# Altium project imx6_devboard.PrjPcb (part 1 of 2)
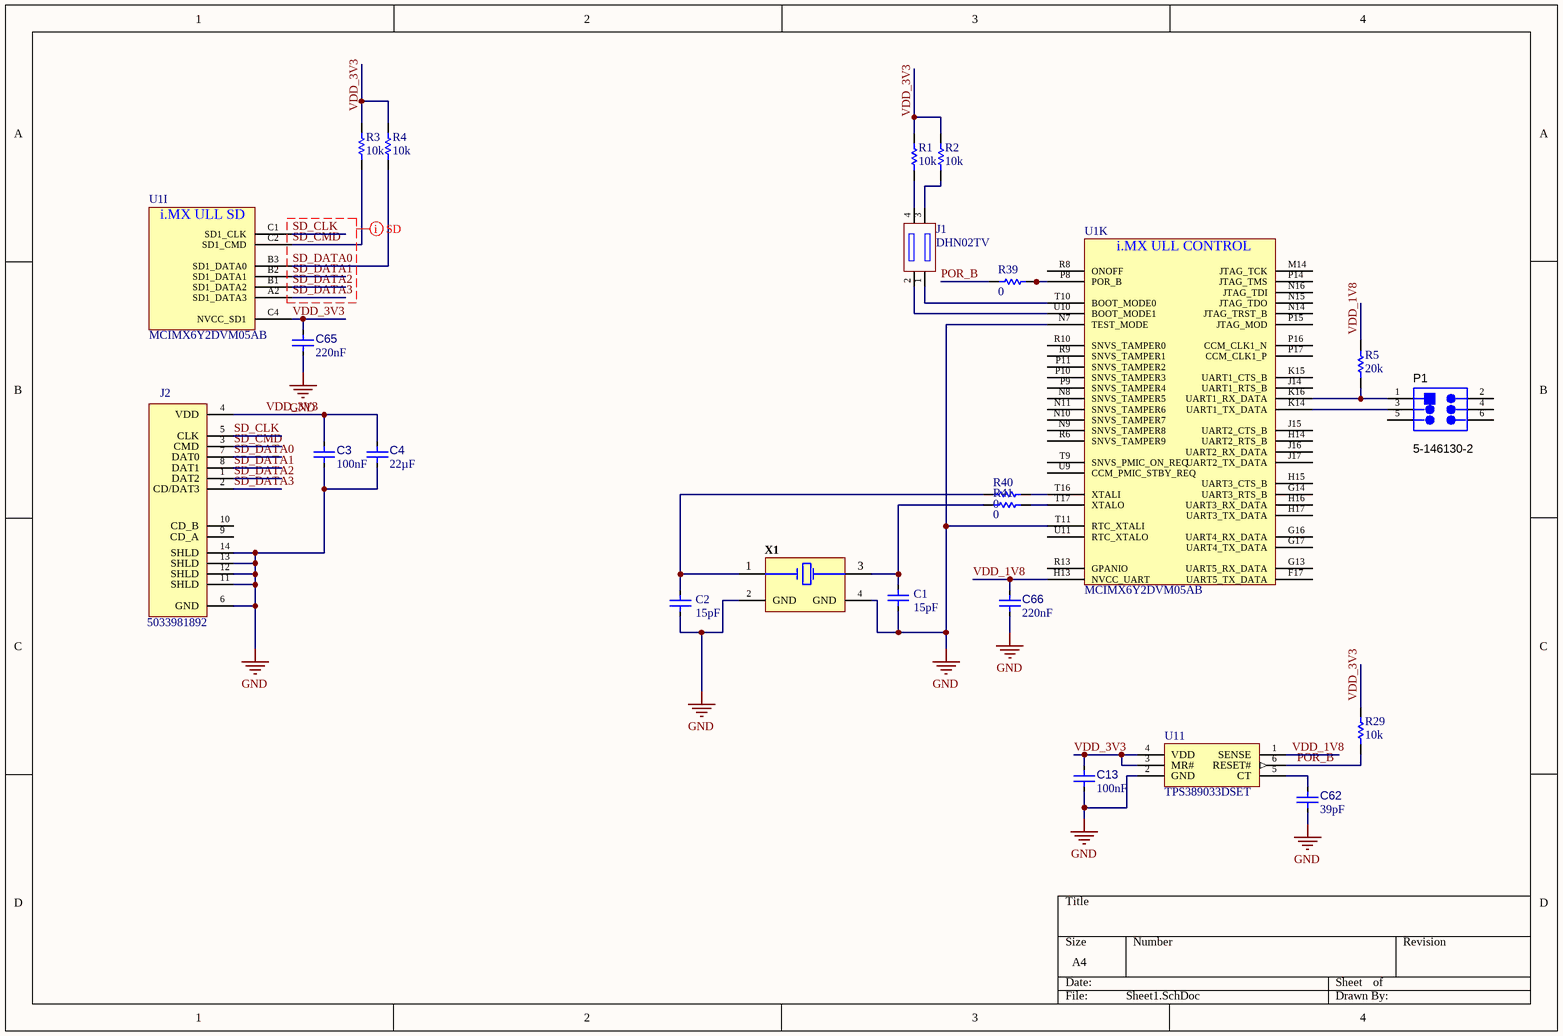
[diagram p0: Sheet1.SchDoc]
6 sheets, 169 parts. Net scope: global (net labels, ports and power ports of the same name join across sheets).
Board file: PCB.PcbDoc
Sheets:
  Sheet1.SchDoc
  Sheet2.SchDoc
  Sheet3.SchDoc
  Sheet4.SchDoc
  Sheet5.SchDoc
  Sheet6.SchDoc

## Sheet Sheet1.SchDoc
size A4; SheetNumber: 1; SheetTotal: 6

### Parts
C1  value 15pF  [0402-SMD-CAP]  (hidden comment: C0402C150J3GACTU)
C2  value 15pF  [0402-SMD-CAP]  (hidden comment: C0402C150J3GACTU)
C3  value 100nF  [0402-SMD-CAP]  (hidden comment: EMF105B7104MVHF)
C4  value 22µF  [0805-SMD-CAP]  (hidden comment: CL21A226MOQNNNE)
C13  value 100nF  [0402-SMD-CAP]  (hidden comment: EMF105B7104MVHF)
C62  value 39pF  [0402-SMD-CAP]  (hidden comment: GRM1555C1H390JA01D)
C65  value 220nF  [0402-SMD-CAP]  (hidden comment: GRM155R71C224KA12D)
C66  value 220nF  [0402-SMD-CAP]  (hidden comment: GRM155R71C224KA12D)
J1  DHN02TV  [DHN02TV-Footprint-1]
J2  5033981892  [MOLX-5033981892_V]
P1  5-146130-2  [TECO-5-146130-2_V]
R1  value 10k  [0402_SMD_RES]  (hidden comment: Resistor 10k +/-1% 0402 63 mW)
R2  value 10k  [0402_SMD_RES]  (hidden comment: Resistor 10k +/-1% 0402 63 mW)
R3  value 10k  [0402_SMD_RES]  (hidden comment: Resistor 10k +/-1% 0402 63 mW)
R4  value 10k  [0402_SMD_RES]  (hidden comment: Resistor 10k +/-1% 0402 63 mW)
R5  value 20k  [0603-SMD-RES]  (hidden comment: CRCW060320K0FKEA)
R29  value 10k  [0402_SMD_RES]  (hidden comment: Resistor 10k +/-1% 0402 63 mW)
R39  value 0  [0402_SMD_RES]  (hidden comment: RCS04020000Z0ED)
R40  value 0  [0402_SMD_RES]  (hidden comment: RCS04020000Z0ED)
R41  value 0  [0402_SMD_RES]  (hidden comment: RCS04020000Z0ED)
U1  MCIMX6Y2DVM05AB  [BGA100P9X9-81A]  (parts I,K of 11)
U11  TPS389033DSET  [TPS389033DSET-Footprint-1]
X1  TSX-322524.0000MF15X-AC3  [EPSON-TSX-3225_V]  (value not drawn)

### Nets
GND: C1.2 C2.2 C3.1 C4.1 C13.1 C62.2 C65.2 C66.2 J2.6(GND) J2.11(SHLD) J2.12(SHLD) J2.13(SHLD) J2.14(SHLD) U1.N7(TEST_MODE) U1.T11(RTC_XTALI) U11.2(GND) X1.2(GND) X1.4(GND)
POR_B: R29.1 R39.1 U11.6(RESET#)
SD_CLK: J2.5(CLK) U1.C1(SD1_CLK)
SD_CMD: J2.3(CMD) R3.1 U1.C2(SD1_CMD)
SD_DATA0: J2.7(DAT0) R4.1 U1.B3(SD1_DATA0)
SD_DATA1: J2.8(DAT1) U1.B2(SD1_DATA1)
SD_DATA2: J2.1(DAT2) U1.B1(SD1_DATA2)
SD_DATA3: J2.2(CD/DAT3) U1.A2(SD1_DATA3)
VDD_1V8: C66.1 R5.2 U1.H13(NVCC_UART) U11.1(SENSE)
VDD_3V3: C3.2 C4.2 C13.2 C65.1 J2.4(VDD) R1.2 R2.2 R3.2 R4.2 R29.2 U1.C4(NVCC_SD1) U11.3(MR#) U11.4(VDD)
NetC1_1: C1.1 R41.1 X1.3(X2)
NetC2_1: C2.1 R40.1 X1.1(X1)
NetC62_1: C62.1 U11.5(CT)
NetJ1_1: J1.1 U1.T10(BOOT_MODE0)
NetJ1_2: J1.2 U1.U10(BOOT_MODE1)
NetJ1_3: J1.3 R2.1
NetJ1_4: J1.4 R1.1
NetP1_1: P1.1 R5.1 U1.K16(UART1_RX_DATA)
NetP1_3: P1.3 U1.K14(UART1_TX_DATA)
NetR39_2: R39.2 U1.P8(POR_B)
NetR40_2: R40.2 U1.T16(XTALI)
NetR41_2: R41.2 U1.T17(XTALO)

Not connected (* = marked no-connect by the designer): J2 9(CD_A) 10(CD_B); P1 2 4 5 6; U1 F17(UART5_TX_DATA) G13(UART5_RX_DATA) G14(UART3_RTS_B) G16(UART4_RX_DATA) G17(UART4_TX_DATA) H14(UART2_RTS_B) H15(UART3_CTS_B) H16(UART3_RX_DATA) H17(UART3_TX_DATA) J14(UART1_RTS_B) J15(UART2_CTS_B) J16(UART2_RX_DATA) J17(UART2_TX_DATA) K15(UART1_CTS_B) M14(JTAG_TCK) N8(SNVS_TAMPER5) N9(SNVS_TAMPER8) N10(SNVS_TAMPER7) N11(SNVS_TAMPER6) N14(JTAG_TRST_B) N15(JTAG_TDO) N16(JTAG_TDI) P9(SNVS_TAMPER4) P10(SNVS_TAMPER3) P11(SNVS_TAMPER2) P14(JTAG_TMS) P15(JTAG_MOD) P16(CCM_CLK1_N) P17(CCM_CLK1_P) R6(SNVS_TAMPER9) R8(ONOFF) R9(SNVS_TAMPER1) R10(SNVS_TAMPER0) R13(GPANIO) T9(SNVS_PMIC_ON_REQ) U9(CCM_PMIC_STBY_REQ) U11(RTC_XTALO)

### Layout directives
net class SD; rule Matched Net Lengths [Delay Tolerance = 100ps]: SD_CLK, SD_CMD, SD_DATA0, SD_DATA1, SD_DATA2, SD_DATA3

### Notes on the sheet
- (in symbol CMP-003-000001-14, part I) i.MX ULL SD
- (in symbol CMP-003-000001-14, part K) i.MX ULL CONTROL

### Library data of the parts
C1 C2 = CMP-001-00085-9: Cap Ceramic 15pF 25V C0G 5% SMD 0402 125C Paper T/R; Tolerance: 5%; Voltage Rating: 25V; Capacitor Type: Ceramic
C3 C13 = CMP-001-00001-14: Chip Capacitor, 0.1 uF, +/- 5%, 16 V, 0402 (1005 Metric); Capacitor Type: Ceramic; Voltage Rating: 16V; Case/Package: 0402; Max Operating Temperature: 125°C; Mounting Technology: SM; RoHS Compliant: True; Pins: 2; Min Operating Temperature: -55°C; Tolerance: 5%; Mfr. Part No.: EMF105B7104MVHF
C4 = CMP-001-00081-10: Chip Capacitor, 22µF +/-40%, 16V, 0805, Thickness 1.45 mm; Tolerance: 5%; Min Operating Temperature: -55°C; Case/Package: 0805; Max Operating Temperature: 85°C; Pins: 2; Mounting Technology: SMT; Voltage Rating: 16V; Mfr. Part No.: CL21A226MOQNNNE
C62 = CMP-001-00088-5: Cap Ceramic 39pF 50V C0G 5% SMD 0402 125C Paper T/R; Temperature Coefficient: 30ppm/°C; Capacitance: 39pF; Case/Package: 0402; Package Quantity: 10000; Series: GRM; Termination: SMD/SMT; Width: 0.02inch; Dielectric: C0G; Thickness: 0.022inch; Construction: Flat; Min Operating Temperature: -55°C; Case Code (Imperial): 0402; Radiation Hardening: No; Voltage: 50V; Number of Pins: 2; Lead Free: Lead Free; Height: 0.5mm; Depth: 0.5mm; Material: Ceramic; Length: 1mm; REACH SVHC: No SVHC; Packaging: Tape and Reel; Max Operating Temperature: 125°C; Voltage Rating (DC): 50V; Case Code (Metric): 1005; Mount: Surface Mount; Voltage Rating: 50V; Tolerance: 5%
C65 C66 = CMP-001-00090-10: MURATA - GRM155R71C224KA12D - SMD Multilayer Ceramic Capacitor, 0.22 µF, 16 V, 0402 [1005 Metric], ± 10%, X7R, GRM Series; Voltage: 16V; Package Quantity: 1; Height: 0.5mm; Tolerance: 10%; Case/Package: 0402; Case Code (Metric): 1005; Packaging: Tape and Reel; Min Operating Temperature: -55°C; Mount: Surface Mount; RoHS Compliant: Yes; Thickness: 0.022inch; Depth: 0.5mm; Lead Free: Lead Free; Series: GRM; REACH SVHC: No SVHC; Width: 0.02inch; Voltage Rating: 16V; Material: Ceramic; Radiation Hardening: No; Voltage Rating (DC): 16V; Capacitance: 220nF; Max Operating Temperature: 125°C; Length: 1mm; Construction: Flat; Dielectric: X7R; Termination: SMD/SMT; Case Code (Imperial): 0402
J1 = CMP-00003-7: 1/2 Pitch DIP Switch; Voltage Rating (DC): 50V; Number of Positions: 2; Min Operating Temperature: -40°C; Mount: Surface Mount; Max Operating Temperature: 85°C; Terminal Pitch: 1.27mm; Package Quantity: 125; Contact Material: Bronze; Contact Plating: Gold
J2 = CMP-002-00049-6: Micro SD Card Connector, Pitch 1.1 mm, 8 Position, Height 1.4 mm, -25 to 85 degC, RoHS, Tape and Reel; Pins: 14
P1 = CMP-002-00018-5: Male Header, Pitch 2.54 mm, 2 x 3 Position, Height 8.13 mm, -65 to 125 degC, RoHS, Tube; Manufacturer: TE Connectivity; Gender: Male; Min Operating Temperature: -65°C; Datasheet Version: Oct-15; Connector Type: Header; RoHS Compliant: Unknown; Max Operating Temperature: 125°C; Case/Package: 5-146130-2; Package Reference: 5-146130-2; Mounting Technology: SM; Manufacturer URL: http://www.te.com/; Package Description: Male Header, Pitch 2.54 mm, 2 x 3 Position, Height 8.13 mm; Datasheet URL: http://www.te.com/commerce/DocumentDelivery/DDEController?Action=showdoc&DocId=Customer+Drawing%7F146130%7FM%7Fpdf%7FEnglish%7FENG_CD_146130_M.pdf%7F5-146130-2
R1-R4 R29 = CMP-009-00019-13: Chip Resistor, 10 KOhm, +/- 1%, 63 mW, -55 to 155 degC, 0402 (1005 Metric); Voltage Rating: 50V; Power: 63mW; Min Operating Temperature: -55°C; Pins: 2; Case/Package: 0402; Max Operating Temperature: 155°C; Resistance: 10k; Mounting Technology: SM; RoHS Compliant: True; Tolerance: 1%
R5 = CMP-009-00191-5: VISHAY - CRCW060320K0FKEA - SMD Chip Resistor, 0603 [1608 Metric], 20 kohm, CRCW e3 Series, 75 V, Thick Film, 100 mW; Voltage Rating: 75V; Power Rating: 100mW; Temperature Coefficient: 100ppm/°C; Tolerance: 1%; Length: 1.55mm; Mount: Surface Mount; Number of Terminations: 2; Case Code (Imperial): 0603; Termination: SMD/SMT; Radiation Hardening: No; RoHS Compliant: Yes; Max Operating Temperature: 155°C; Lead Free: Lead Free; Series: CRCW; REACH SVHC: Unknown; Max Power Dissipation: 100mW; Depth: 0.85mm; Case/Package: 0603; Package Quantity: 5000; Case Code (Metric): 1608; Size Code: 0603; Width: 0.85mm; Contact Plating: Tin,Lead; Construction: Rectangular; Weight: 7.1E-05oz; Resistance: 20k; Military Standard: Not; Features: Automotive AEC-Q200; Min Operating Temperature: -55°C; Packaging: Tape and Reel; Resistor Type: Thick Film; Height: 0.45mm; Resistance Tolerance: 1%; Number of Pins: 2; Voltage Rating (DC): 75V
R39-R41 = CMP-009-00005-12: Chip Resistor, 0 Ohm, 0.1 W, -55 to 155 degC, 0402 (1005 Metric); Voltage Rating: 50V; Tolerance: 5%; Power: 100mW; Min Operating Temperature: -55°C; Mounting Technology: SM; RoHS Compliant: True; Max Operating Temperature: 155°C; Pins: 2; Case/Package: 0402; Mfr. Part No.: RCS04020000Z0ED
U1 = CMP-003-000001-14: Package: MAPBGA; Design Item ID: MCIMX6Y2DVM05AB; Mfr. Part Nr.: MCIMX6Y2DVM05AB; Source: Schlib1.SchLib
U11 = CMP-016-00010-6: TEXAS INSTRUMENTS         TPS389033DSET             Voltage Supervisor, 1.5V-5.5Vsupp., 3.17V threshold/30 s delay, Active-Low reset, WSON-6                          New; Min Supply Voltage: 1.5V; Max Supply Voltage: 5.5V; Quiescent Current: 2uA; Min Operating Temperature: -40°C; RoHS Compliant: Yes; Threshold Voltage: 3.17V; Max Operating Temperature: 125°C; Packaging: Cut Tape; Lead Free: Lead Free; Number of Pins: 6; REACH SVHC: No SVHC
X1 = CMP-003-00030-8: CRYSTAL 24.0000MHZ 9PF SMD

## Sheet Sheet2.SchDoc: DDR3L
size A4; SheetNumber: 2; SheetTotal: 6
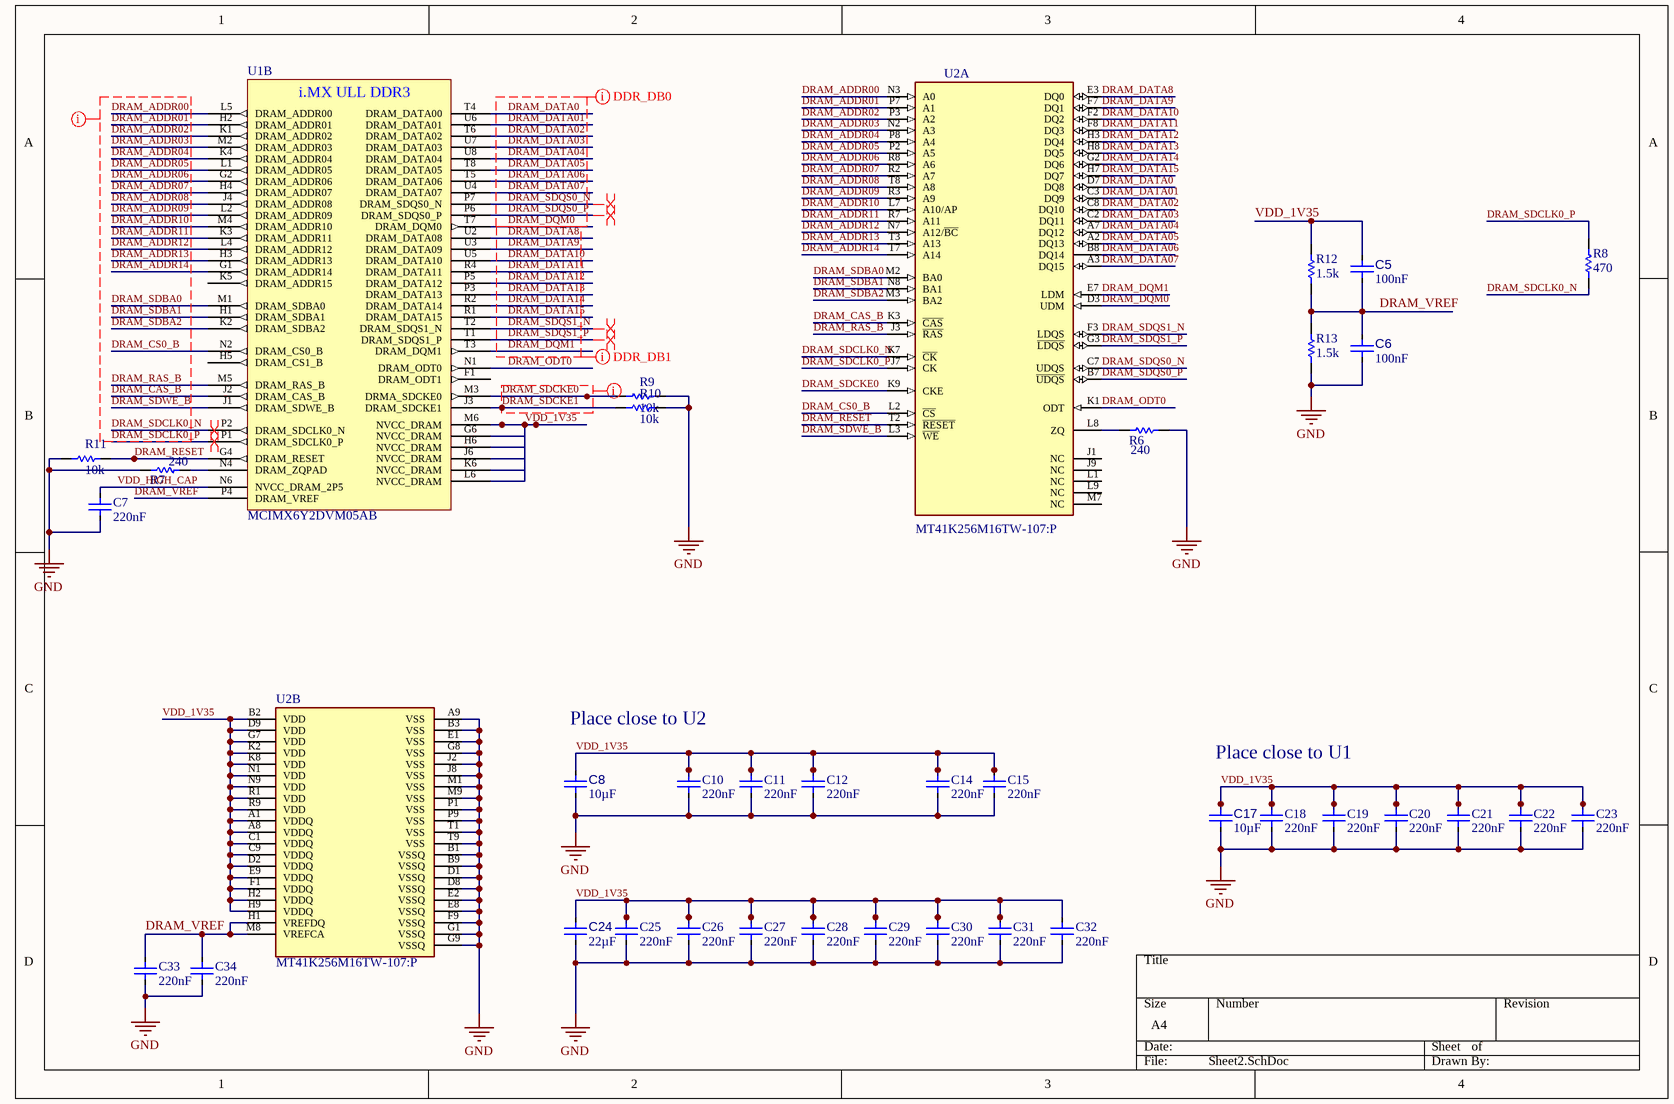
[diagram p1: Sheet2.SchDoc]

### Parts
C5  value 100nF  [0402-SMD-CAP]  (hidden comment: EMF105B7104MVHF)
C6  value 100nF  [0402-SMD-CAP]  (hidden comment: EMF105B7104MVHF)
C7  value 220nF  [0402-SMD-CAP]  (hidden comment: 0402ZD224KAT2A)
C8  value 10µF  [0603-SMD-CAP]  (hidden comment: 0603ZD106KAT2A)
C10  value 220nF  [0402-SMD-CAP]  (hidden comment: 0402ZD224KAT2A)
C11  value 220nF  [0402-SMD-CAP]  (hidden comment: 0402ZD224KAT2A)
C12  value 220nF  [0402-SMD-CAP]  (hidden comment: 0402ZD224KAT2A)
C14  value 220nF  [0402-SMD-CAP]  (hidden comment: 0402ZD224KAT2A)
C15  value 220nF  [0402-SMD-CAP]  (hidden comment: 0402ZD224KAT2A)
C17  value 10µF  [0603-SMD-CAP]  (hidden comment: 0603ZD106KAT2A)
C18  value 220nF  [0402-SMD-CAP]  (hidden comment: 0402ZD224KAT2A)
C19  value 220nF  [0402-SMD-CAP]  (hidden comment: 0402ZD224KAT2A)
C20  value 220nF  [0402-SMD-CAP]  (hidden comment: 0402ZD224KAT2A)
C21  value 220nF  [0402-SMD-CAP]  (hidden comment: 0402ZD224KAT2A)
C22  value 220nF  [0402-SMD-CAP]  (hidden comment: 0402ZD224KAT2A)
C23  value 220nF  [0402-SMD-CAP]  (hidden comment: 0402ZD224KAT2A)
C24  value 22µF  [0805-SMD-CAP]  (hidden comment: CL21A226MOQNNNE)
C25  value 220nF  [0402-SMD-CAP]  (hidden comment: 0402ZD224KAT2A)
C26  value 220nF  [0402-SMD-CAP]  (hidden comment: 0402ZD224KAT2A)
C27  value 220nF  [0402-SMD-CAP]  (hidden comment: 0402ZD224KAT2A)
C28  value 220nF  [0402-SMD-CAP]  (hidden comment: 0402ZD224KAT2A)
C29  value 220nF  [0402-SMD-CAP]  (hidden comment: 0402ZD224KAT2A)
C30  value 220nF  [0402-SMD-CAP]  (hidden comment: 0402ZD224KAT2A)
C31  value 220nF  [0402-SMD-CAP]  (hidden comment: 0402ZD224KAT2A)
C32  value 220nF  [0402-SMD-CAP]  (hidden comment: 0402ZD224KAT2A)
C33  value 220nF  [0402-SMD-CAP]  (hidden comment: 0402ZD224KAT2A)
C34  value 220nF  [0402-SMD-CAP]  (hidden comment: 0402ZD224KAT2A)
R6  value 240  [0402_SMD_RES]  (hidden comment: RC0402FR-07240RL)
R7  value 240  [0402_SMD_RES]  (hidden comment: RC0402FR-07240RL)
R8  value 470  [0402_SMD_RES]  (hidden comment: CRCW0402470RFKED)
R9  value 10k  [0402_SMD_RES]  (hidden comment: CRCW040210K0FKTD)
R10  value 10k  [0402_SMD_RES]  (hidden comment: CRCW040210K0FKTD)
R11  value 10k  [0402_SMD_RES]  (hidden comment: CRCW040210K0FKTD)
R12  value 1.5k  [0402_SMD_RES]  (hidden comment: ERJ-2RKF1501X)
R13  value 1.5k  [0402_SMD_RES]  (hidden comment: ERJ-2RKF1501X)
U1  MCIMX6Y2DVM05AB  [BGA100P9X9-81A]  (part B of 11)
U2  MT41K256M16TW-107:P  [FP-TW-IPC_B]  (parts A,B of 2)

### Nets
GND: C6.1 C7.1 C8.1 C10.1 C11.1 C12.1 C14.1 C15.1 C17.1 C18.1 C19.1 C20.1 C21.1 C22.1 C23.1 C24.1 C25.1 C26.1 C27.1 C28.1 C29.1 C30.1 C31.1 C32.1 C33.1 C34.1 R6.2 R7.1 R9.2 R10.2 R11.1 R13.1 U2.A9(VSS) U2.B1(VSSQ) U2.B3(VSS) U2.B9(VSSQ) U2.D1(VSSQ) U2.D8(VSSQ) U2.E1(VSS) U2.E2(VSSQ) U2.E8(VSSQ) U2.F9(VSSQ) U2.G1(VSSQ) U2.G8(VSS) U2.G9(VSSQ) U2.J2(VSS) U2.J8(VSS) U2.M1(VSS) U2.M9(VSS) U2.P1(VSS) U2.P9(VSS) U2.T1(VSS) U2.T9(VSS)
DRAM_ADDR00: U1.L5(DRAM_ADDR00) U2.N3(A0)
DRAM_ADDR01: U1.H2(DRAM_ADDR01) U2.P7(A1)
DRAM_ADDR02: U1.K1(DRAM_ADDR02) U2.P3(A2)
DRAM_ADDR03: U1.M2(DRAM_ADDR03) U2.N2(A3)
DRAM_ADDR04: U1.K4(DRAM_ADDR04) U2.P8(A4)
DRAM_ADDR05: U1.L1(DRAM_ADDR05) U2.P2(A5)
DRAM_ADDR06: U1.G2(DRAM_ADDR06) U2.R8(A6)
DRAM_ADDR07: U1.H4(DRAM_ADDR07) U2.R2(A7)
DRAM_ADDR08: U1.J4(DRAM_ADDR08) U2.T8(A8)
DRAM_ADDR09: U1.L2(DRAM_ADDR09) U2.R3(A9)
DRAM_ADDR10: U1.M4(DRAM_ADDR10) U2.L7(A10/AP)
DRAM_ADDR11: U1.K3(DRAM_ADDR11) U2.R7(A11)
DRAM_ADDR12: U1.L4(DRAM_ADDR12) U2.N7(A12/~{BC})
DRAM_ADDR13: U1.H3(DRAM_ADDR13) U2.T3(A13)
DRAM_ADDR14: U1.G1(DRAM_ADDR14) U2.T7(A14)
DRAM_CAS_B: U1.J2(DRAM_CAS_B) U2.K3(~{CAS})
DRAM_CS0_B: U1.N2(DRAM_CS0_B) U2.L2(~{CS})
DRAM_DATA0: U1.T4(DRAM_DATA00) U2.D7(DQ8)
DRAM_DATA01: U1.U6(DRAM_DATA01) U2.C3(DQ9)
DRAM_DATA02: U1.T6(DRAM_DATA02) U2.C8(DQ10)
DRAM_DATA03: U1.U7(DRAM_DATA03) U2.C2(DQ11)
DRAM_DATA04: U1.U8(DRAM_DATA04) U2.A7(DQ12)
DRAM_DATA05: U1.T8(DRAM_DATA05) U2.A2(DQ13)
DRAM_DATA06: U1.T5(DRAM_DATA06) U2.B8(DQ14)
DRAM_DATA07: U1.U4(DRAM_DATA07) U2.A3(DQ15)
DRAM_DATA8: U1.U2(DRAM_DATA08) U2.E3(DQ0)
DRAM_DATA9: U1.U3(DRAM_DATA09) U2.F7(DQ1)
DRAM_DATA10: U1.U5(DRAM_DATA10) U2.F2(DQ2)
DRAM_DATA11: U1.R4(DRAM_DATA11) U2.F8(DQ3)
DRAM_DATA12: U1.P5(DRAM_DATA12) U2.H3(DQ4)
DRAM_DATA13: U1.P3(DRAM_DATA13) U2.H8(DQ5)
DRAM_DATA14: U1.R2(DRAM_DATA14) U2.G2(DQ6)
DRAM_DATA15: U1.R1(DRAM_DATA15) U2.H7(DQ7)
DRAM_DQM0: U1.T7(DRAM_DQM0) U2.D3(UDM)
DRAM_DQM1: U1.T3(DRAM_DQM1) U2.E7(LDM)
DRAM_ODT0: U1.N1(DRAM_ODT0) U2.K1(ODT)
DRAM_RAS_B: U1.M5(DRAM_RAS_B) U2.J3(~{RAS})
DRAM_RESET: R11.2 U1.G4(DRAM_RESET) U2.T2(~{RESET})
DRAM_SDBA0: U1.M1(DRAM_SDBA0) U2.M2(BA0)
DRAM_SDBA1: U1.H1(DRAM_SDBA1) U2.N8(BA1)
DRAM_SDBA2: U1.K2(DRAM_SDBA2) U2.M3(BA2)
DRAM_SDCKE0: R9.1 U1.M3(DRMA_SDCKE0) U2.K9(CKE)
DRAM_SDCKE1: R10.1 U1.J3(DRAM_SDCKE1)
DRAM_SDCLK0_N: R8.1 U1.P2(DRAM_SDCLK0_N) U2.K7(~{CK})
DRAM_SDCLK0_P: R8.2 U1.P1(DRAM_SDCLK0_P) U2.J7(CK)
DRAM_SDQS0_N: U1.P7(DRAM_SDQS0_N) U2.C7(UDQS)
DRAM_SDQS0_P: U1.P6(DRAM_SDQS0_P) U2.B7(~{UDQS})
DRAM_SDQS1_N: U1.T2(DRAM_SDQS1_N) U2.F3(LDQS)
DRAM_SDQS1_P: U1.T1(DRAM_SDQS1_P) U2.G3(~{LDQS})
DRAM_SDWE_B: U1.J1(DRAM_SDWE_B) U2.L3(~{WE})
DRAM_VREF: C5.1 C6.2 C33.2 C34.2 R12.1 R13.2 U1.P4(DRAM_VREF) U2.H1(VREFDQ) U2.M8(VREFCA)
VDD_1V35: C5.2 C8.2 C10.2 C11.2 C12.2 C14.2 C15.2 C17.2 C18.2 C19.2 C20.2 C21.2 C22.2 C23.2 C24.2 C25.2 C26.2 C27.2 C28.2 C29.2 C30.2 C31.2 C32.2 R12.2 U1.G6(NVCC_DRAM) U1.H6(NVCC_DRAM) U1.J6(NVCC_DRAM) U1.K6(NVCC_DRAM) U1.L6(NVCC_DRAM) U1.M6(NVCC_DRAM) U2.A1(VDDQ) U2.A8(VDDQ) U2.B2(VDD) U2.C1(VDDQ) U2.C9(VDDQ) U2.D2(VDDQ) U2.D9(VDD) U2.E9(VDDQ) U2.F1(VDDQ) U2.G7(VDD) U2.H2(VDDQ) U2.H9(VDDQ) U2.K2(VDD) U2.K8(VDD) U2.N1(VDD) U2.N9(VDD) U2.R1(VDD) U2.R9(VDD)
VDD_HIGH_CAP: C7.2 U1.N6(NVCC_DRAM_2P5)
NetR6_1: R6.1 U2.L8(ZQ)
NetR7_2: R7.2 U1.N4(DRAM_ZQPAD)

Not connected (* = marked no-connect by the designer): U1 F1(DRAM_ODT1) H5(DRAM_CS1_B) K5(DRAM_ADDR15); U2 J1(NC) J9(NC) L1(NC) L9(NC) M7(NC)

### Layout directives
differential pair: DRAM_SDCLK0_N, DRAM_SDCLK0_P, DRAM_SDQS0_N, DRAM_SDQS0_P, DRAM_SDQS1_N, DRAM_SDQS1_P
net class DDR_ADDR: DRAM_ADDR00, DRAM_ADDR01, DRAM_ADDR02, DRAM_ADDR03, DRAM_ADDR04, DRAM_ADDR05, DRAM_ADDR06, DRAM_ADDR07, DRAM_ADDR08, DRAM_ADDR09, DRAM_ADDR10, DRAM_ADDR11, DRAM_ADDR12, DRAM_ADDR13, DRAM_ADDR14, DRAM_CAS_B, DRAM_CS0_B, DRAM_RAS_B, DRAM_SDBA0, DRAM_SDBA1, DRAM_SDBA2, DRAM_SDCKE0, DRAM_SDCLK0_N, DRAM_SDCLK0_P, DRAM_SDWE_B
net class DDR_DB0: DRAM_DATA0, DRAM_DATA01, DRAM_DATA02, DRAM_DATA03, DRAM_DATA04, DRAM_DATA05, DRAM_DATA06, DRAM_DATA07, DRAM_SDQS0_N, DRAM_SDQS0_P
net class DDR_DB1: DRAM_DATA8, DRAM_DATA9, DRAM_DATA10, DRAM_DATA11, DRAM_DATA12, DRAM_DATA13, DRAM_DATA14, DRAM_DATA15, DRAM_DQM0, DRAM_DQM1, DRAM_SDQS1_N, DRAM_SDQS1_P

### Notes on the sheet
- Place close to U2
- Place close to U1
- (in symbol CMP-003-000001-14, part B) i.MX ULL DDR3

### Library data of the parts
C5 C6 = CMP-001-00001-14: as C3 on sheet Sheet1; Case/Package: 0402; Max Operating Temperature: 125°C; Mounting Technology: SM; RoHS Compliant: True; Pins: 2; Min Operating Temperature: -55°C; Tolerance: 5%; Mfr. Part No.: EMF105B7104MVHF
C7 C10-C12 C14 C15 C18-C23 C25-C34 = CMP-001-00057-16: Chip Capacitor, 220nF +/-20%, 10V, 0402, Thickness 0.6 mm; Tolerance: 10%; Mounting Technology: SMT; Max Operating Temperature: 85°C; Min Operating Temperature: -55°C; Pins: 2; Voltage Rating: 10V; Case/Package: 0402; Mfr. Part No.: 0402ZD224KAT2A
C8 C17 = CMP-001-00075-11: Chip Capacitor, 10µF +/-20%, 10V, 0603, Thickness 1 mm; Tolerance: 10%; Pins: 2; Max Operating Temperature: 85°C; Case/Package: 0603; Voltage Rating: 10V; Mounting Technology: SMT; Min Operating Temperature: -55°C; Mfr. Part No.: 0603ZD106KAT2A
C24 = CMP-001-00081-10: as C4 on sheet Sheet1; Case/Package: 0805; Min Operating Temperature: -55°C; Pins: 2; Voltage Rating: 16V; Max Operating Temperature: 85°C; Mounting Technology: SMT; Mfr. Part No.: CL21A226MOQNNNE
R6 R7 = CMP-009-00180-9: Res Thick Film 0402 240 Ohm 1% 0.063W(1/16W) ±100ppm/C Molded SMD Paper T/R; Voltage Rating: 50V; Max Power Dissipation: 63mW; Resistance: 240R; Temperature Coefficient: 100ppm/°C; Resistor Type: Thick Film; REACH SVHC: Unknown; Width: 0.02inch; Height: 0.016inch; Series: RC; Case Code (Imperial): 0402; Features: Moisture Resistant; Termination: SMD/SMT; Military Standard: Not; Resistance Tolerance: 1%; Depth: 0.5mm; RoHS Compliant: Yes; Package Quantity: 1; Case Code (Metric): 1005; Lead Free: Lead Free; Power Rating: 63mW; Size Code: 0402; Packaging: Tape and Reel; Case/Package: 0402; Construction: Rectangular; Voltage Rating (DC): 50V; Tolerance: 1%; Max Operating Temperature: 155°C; Number of Terminations: 2; Min Operating Temperature: -55°C; Length: 1mm
R8 = CMP-009-00178-9: RES SMD 470 OHM 1% 1/16W 0402; Power: 2.66W; Resistance: 470; Case/Package: 0402; Tolerance: 1%
R9-R11 = CMP-009-00149-9: Chip Resistor, 10 kOhms, +/-1 %, 63 mW, -55 to 125 degC, 0402; Power: 63mW; Tolerance: 1%; Pins: 2; Max Operating Temperature: 155°C; Min Operating Temperature: -55°C; Case/Package: 0402; Mfr. Part No.: CRCW040210K0FKTD
R12 R13 = CMP-009-00181-8: PANASONIC - ERJ2RKF1501X - RES, 1K5, 1%, 0.1W, 0402, THICK FILM; Max Power Dissipation: 100mW; Voltage Rating: 50V; Temperature Coefficient: 100ppm/°C; Packaging: Tape and Reel; Height: 0.35mm; Case Code (Metric): 1005; Max Operating Temperature: 155°C; Power Rating: 100mW; Resistor Type: Thick Film; Contact Plating: Tin; Case/Package: 0402; Width: 0.02inch; Size Code: 0402; Length: 1mm; Min Operating Temperature: -55°C; Tolerance: 1%; RoHS Compliant: Yes; Resistance: 1.5k; Package Quantity: 1; Resistance Tolerance: 1%; Mount: Surface Mount; Depth: 0.5mm; Military Standard: Not; Termination: SMD/SMT; REACH SVHC: No SVHC; Construction: Rectangular; Features: Automotive AEC-Q200; Radiation Hardening: No; Lead Free: Lead Free; Technology: THICK FILM; Voltage Rating (DC): 50V; Number of Terminations: 2; Number of Pins: 2; Case Code (Imperial): 0402; Series: ERJ
U1 = CMP-003-000001-14: Package: MAPBGA; Design Item ID: MCIMX6Y2DVM05AB; Mfr. Part Nr.: MCIMX6Y2DVM05AB; Source: Schlib1.SchLib
U2 = CMP-019-00049-6: DRAM Chip DDR3L SDRAM 4G-Bit 256Mx16 1.35V 96 FBGA

## Sheet Sheet3.SchDoc
size A4; SheetNumber: 3; SheetTotal: 6
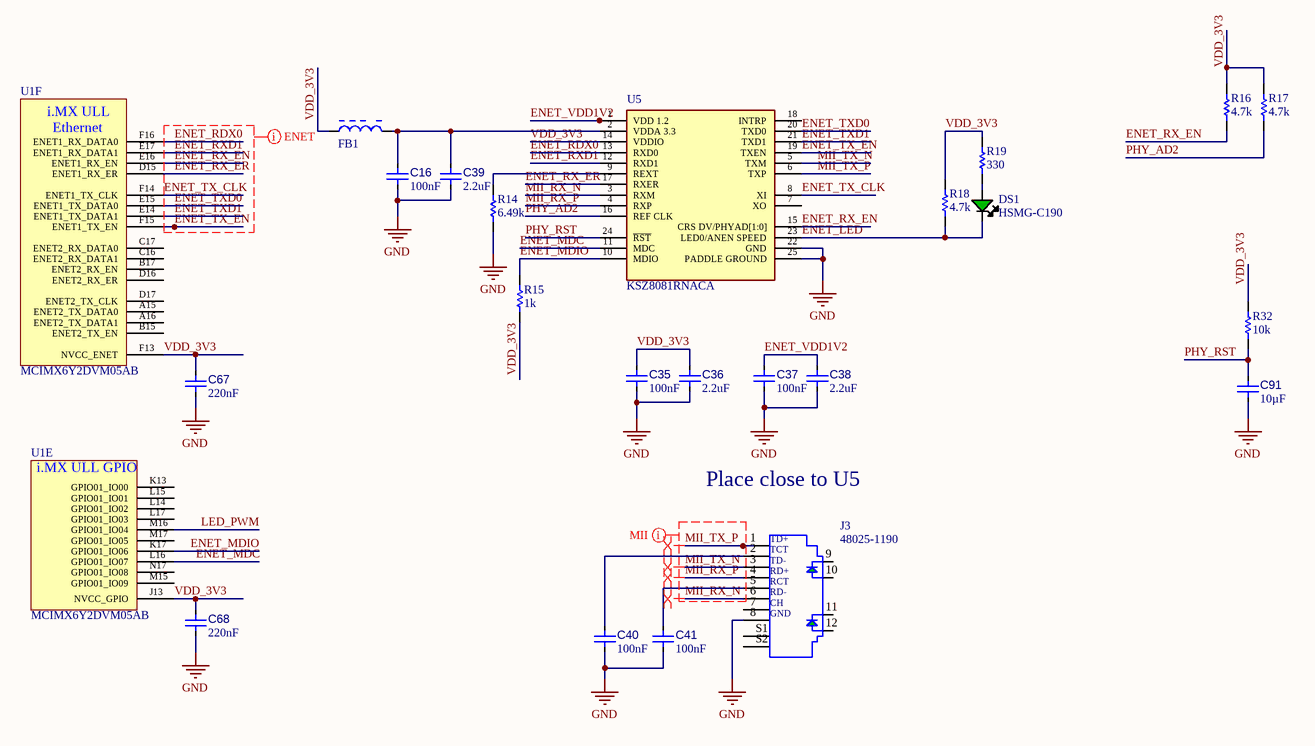
[diagram p2: Sheet3.SchDoc]

### Parts
C16  value 100nF  [0402-SMD-CAP]  (hidden comment: EMF105B7104MVHF)
C35  value 100nF  [0402-SMD-CAP]  (hidden comment: EMF105B7104MVHF)
C36  value 2.2uF  [0603-SMD-CAP]  (hidden comment: GRM188R71A225KE15D)
C37  value 100nF  [0402-SMD-CAP]  (hidden comment: EMF105B7104MVHF)
C38  value 2.2uF  [0603-SMD-CAP]  (hidden comment: GRM188R71A225KE15D)
C39  value 2.2uF  [0603-SMD-CAP]  (hidden comment: GRM188R71A225KE15D)
C40  value 100nF  [0402-SMD-CAP]  (hidden comment: EMF105B7104MVHF)
C41  value 100nF  [0402-SMD-CAP]  (hidden comment: EMF105B7104MVHF)
C67  value 220nF  [0402-SMD-CAP]  (hidden comment: GRM155R71C224KA12D)
C68  value 220nF  [0402-SMD-CAP]  (hidden comment: GRM155R71C224KA12D)
C91  value 10µF  [0603-SMD-CAP]  (hidden comment: 0603ZD106KAT2A)
DS1  HSMG-C190  [AVAG-HSMX-C190_V]
FB1  BLM21BB221SN1D  [MURA-BLM21-H1-CHIP-2_V]  (value not drawn)
J3  48025-1190  [MOLX-48025-1190_V]
R14  value 6.49k  [0402_SMD_RES]  (hidden comment: CRCW04026K49FKED)
R15  value 1k  [0402_SMD_RES]  (hidden comment: ERJ-2RKF1001X)
R16  value 4.7k  [0402_SMD_RES]  (hidden comment: RC0402FR-074K7L)
R17  value 4.7k  [0402_SMD_RES]  (hidden comment: RC0402FR-074K7L)
R18  value 4.7k  [0402_SMD_RES]  (hidden comment: RC0402FR-074K7L)
R19  value 330  [0402_SMD_RES]  (hidden comment: CRCW0402330RJNTD)
R32  value 10k  [0402_SMD_RES]  (hidden comment: CRCW040210K0FKTD)
U1  MCIMX6Y2DVM05AB  [BGA100P9X9-81A]  (parts E,F of 11)
U5  KSZ8081RNACA  [FP-QFN44-24LD-PL-1-IPC_C]

### Nets
GND: C16.1 C35.1 C36.1 C37.1 C38.1 C39.1 C40.1 C41.1 C67.2 C68.2 C91.2 J3.8(GND) R14.1 U5.22(GND) U5.25(PADDLE_GROUND)
ENET_LED: DS1.2(K) R18.1 U5.23(LED0/ANEN_SPEED)
ENET_MDC: U1.L16(GPIO01_IO07) U5.11(MDC)
ENET_MDIO: R15.2 U1.K17(GPIO01_IO06) U5.10(MDIO)
ENET_RDX0: U1.F16(ENET1_RX_DATA0) U5.13(RXD0)
ENET_RX_EN: R16.1 U1.E16(ENET1_RX_EN) U5.15(CRS_DV/PHYAD[1:0])
ENET_RX_ER: U1.D15(ENET1_RX_ER) U5.17(RXER)
ENET_RXD1: U1.E17(ENET1_RX_DATA1) U5.12(RXD1)
ENET_TX_CLK: U1.F14(ENET1_TX_CLK) U5.8(XI)
ENET_TX_EN: U1.F15(ENET1_TX_EN) U5.19(TXEN)
ENET_TXD0: U1.E15(ENET1_TX_DATA0) U5.20(TXD0)
ENET_TXD1: U1.E14(ENET1_TX_DATA1) U5.21(TXD1)
ENET_VDD1V2: C37.2 C38.2 U5.1(VDD_1.2)
LED_PWM: U1.M16(GPIO01_IO04)
MII_RX_N: J3.6(RD-) U5.3(RXM)
MII_RX_P: J3.4(RD+) U5.4(RXP)
MII_TX_N: J3.3(TD-) U5.5(TXM)
MII_TX_P: J3.1(TD+) U5.6(TXP)
PHY_AD2: R17.1 U5.16(REF_CLK)
PHY_RST: C91.1 R32.1 U5.24(~{RST})
VDD_3V3: C35.2 C36.2 C67.1 C68.1 FB1.1 R15.1 R16.2 R17.2 R18.2 R19.2 R32.2 U1.F13(NVCC_ENET) U1.J13(NVCC_GPIO) U5.14(VDDIO)
NetC16_2: C16.2 C39.2 FB1.2 U5.2(VDDA_3.3)
NetC40_2: C40.2 J3.2(TCT)
NetC41_2: C41.2 J3.5(RCT)
NetDS1_1: DS1.1(A) R19.1
NetR14_2: R14.2 U5.9(REXT)

Not connected (* = marked no-connect by the designer): J3 7(CHASSIS) 9 10 11 12 S1 S2; U1 A15(ENET2_TX_DATA0) A16(ENET2_TX_DATA1) B15(ENET2_TX_EN) B17(ENET2_RX_EN) C16(ENET2_RX_DATA1) C17(ENET2_RX_DATA0) D16(ENET2_RX_ER) D17(ENET2_TX_CLK) K13(GPIO01_IO00) L14(GPIO01_IO02) L15(GPIO01_IO01) L17(GPIO01_IO03) M15(GPIO01_IO09) M17(GPIO01_IO05) N17(GPIO01_IO08); U5 7(XO) 18(INTRP)

### Layout directives
net class ENET: ENET_RDX0, ENET_RX_EN, ENET_RX_ER, ENET_RXD1, ENET_TX_CLK, ENET_TX_EN, ENET_TXD0, ENET_TXD1
differential pair: MII_RX_N, MII_RX_P, MII_TX_N, MII_TX_P
net class MII: MII_RX_N, MII_RX_P, MII_TX_N, MII_TX_P

### Notes on the sheet
- Place close to U5
- (in symbol CMP-002-00000-4) CH
- (in symbol CMP-003-000001-14, part E) i.MX ULL GPIO
- (in symbol CMP-003-000001-14, part F) i.MX ULL; Ethernet

### Library data of the parts
C16 C35 C37 C40 C41 = CMP-001-00001-14: as C3 on sheet Sheet1; Case/Package: 0402; Max Operating Temperature: 125°C; Mounting Technology: SM; RoHS Compliant: True; Pins: 2; Min Operating Temperature: -55°C; Tolerance: 5%; Mfr. Part No.: EMF105B7104MVHF
C36 C38 C39 = CMP-001-00083-8: CAP CER 2.2UF 10V X7R 0603; Tolerance: 10%; Material: Ceramic; Height: 0.8mm; Capacitance: 2.2uF; Case Code (Imperial): 0603; Termination: Standard; Voltage Rating (DC): 10V; Voltage: 10V; RoHS Compliant: Yes; Length: 1.6mm; Thickness: 0.035inch; Case Code (Metric): 1608; REACH SVHC: No SVHC; Package Quantity: 4000; Case/Package: 0603; Mount: Surface Mount; Depth: 0.8mm; Packaging: Cut Tape; Lead Free: Lead Free; Series: GRM; Width: 0.8mm; Dielectric: X7R; Number of Pins: 2; Weight: 0.000222oz; Max Operating Temperature: 125°C; Voltage Rating: 10V; Min Operating Temperature: -55°C
C67 C68 = CMP-001-00090-10: as C65 on sheet Sheet1; Package Quantity: 1; Height: 0.5mm; Tolerance: 10%; Case/Package: 0402; Case Code (Metric): 1005; Packaging: Tape and Reel; Min Operating Temperature: -55°C; Mount: Surface Mount; RoHS Compliant: Yes; Thickness: 0.022inch; Depth: 0.5mm; Lead Free: Lead Free; Series: GRM; REACH SVHC: No SVHC; Width: 0.02inch; Voltage Rating: 16V; Material: Ceramic; Radiation Hardening: No; Voltage Rating (DC): 16V; Capacitance: 220nF; Max Operating Temperature: 125°C; Length: 1mm; Construction: Flat; Dielectric: X7R; Termination: SMD/SMT; Case Code (Imperial): 0402
C91 = CMP-001-00075-11: as C8 on sheet Sheet2; Pins: 2; Case/Package: 0603; Mounting Technology: SMT; Max Operating Temperature: 85°C; Min Operating Temperature: -55°C; Voltage Rating: 10V; Mfr. Part No.: 0603ZD106KAT2A
DS1 = CMP-007-00013-5: LED Uni-Color Green, 52 mW, 20 mA, -40 to 85 degC, 2-Pin SMD, RoHS, Tape and Reel; Manufacturer: Avago; Power: 52mW; Forward Voltage: 2.2V; Lens Style: Diffused; Viewing Angle: 170degrees; Luminous Intensity: 15mcd; Forward Current: 20mA; Colour: Green; Pins: 2; Min Operating Temperature: -40°C; Packaging: TapeandReel; Package Quantity: 4000; Manufacturer URL: http://www.avagotech.com/; Case/Package: 0603; RoHS Compliant: True; Datasheet Version: Mar-12; Datasheet URL: http://docs.avagotech.com/docs/AV02-0551EN; Mounting Technology: SM; Package Description: 2-Pin Surface Mount Device, Body 1.6 x 0.8 mm, Height 0.9 mm; Package Reference: HSMX-C190; Illumination Colour: Green; Nominal Vf: 2.2V; Max Operating Temperature: 85°C
FB1 = CMP-006-00021-8: FERRITE CHIP 220 OHM 0805; Current Rating: 500mA; Tolerance: 25%; Test Frequency: 100MHz; Number of Circuits: 1; DC Resistance-Max: 260mR; Material: Ferrite,Steel; Impedance: 220R; Resistance: 350mR; Max DC Current: 200mA; Shielding: Unshielded; Depth: 1.25mm; Max Current Rating: 500mA; Case Code (Imperial): 0805; Case/Package: 0805; Max Operating Temperature: 125°C; Package Quantity: 4000; Width: 1.25mm; Height: 0.85mm; Number of Pins: 2; Min Operating Temperature: -55°C; Termination: SMD/SMT; Length: 2mm; Number of Lines: 1; DC Resistance (DCR): 260mR; Case Code (Metric): 2012; Lead Free: Lead Free; RoHS Compliant: Yes; REACH SVHC: No SVHC; Packaging: Tape and Reel; Series: BLM21B; Core Material: Ferrite
J3 = CMP-002-00000-4: Modular Jack with Integrated Magnetics with LED, 1.5 A, -40 to 70 degC, 12-Pin THD, RoHS, Tray; Manufacturer: Molex; Max Voltage Rating (AC): 150V; Capacitance: -45f; Shielding: Shielded; Current Rating: 1.5A; Gender: Female; Manufacturer URL: http://www.molex.com/; Pins: 8; RoHS Compliant: True; Connector Type: Modular; Lead Pitch: 1.27mm; Housing Material: Nylon; Voltage Rating: 150V; Package Reference: 48025-1190; Contact Material: Brass; Datasheet Version: Rev. G, 01/2012; Max Operating Temperature: 70°C; Package Quantity: 1080; Case/Package: 48025-1190; Mounting Technology: TH; Min Operating Temperature: -40°C; Package Description: 12-Pin Through Hole Device, Body 16.2 x 25.4 mm; Datasheet URL: http://www.molex.com/pdm_docs/sd/480251190_sd.pdf; Packaging: Tray; Contact Plating: Gold
R14 = CMP-009-00182-7: Res Thick Film 0402 6.49K Ohm 1% 0.063W(1/16W) ±100ppm/C Pad SMD Automotive T/R; Voltage Rating: 50V; Temperature Coefficient: 100ppm/°C; Max Power Dissipation: 63mW; Resistance Tolerance: 1%; Width: 0.02inch; REACH SVHC: Unknown; Series: CRCW; Number of Terminations: 2; Max Operating Temperature: 155°C; Termination: SMD/SMT; Mount: Surface Mount; RoHS Compliant: Yes; Construction: Rectangular; Height: 0.35mm; Voltage Rating (DC): 50V; Radiation Hardening: No; Package Quantity: 10; Length: 1mm; Min Operating Temperature: -55°C; Case Code (Metric): 1005; Packaging: Tape and Reel; Lead Free: Lead Free; Contact Plating: Tin; Tolerance: 1%; Technology: THICK FILM; Military Standard: Not; Depth: 0.5mm; Resistance: 6.49k; Number of Pins: 2; Case/Package: 0402; Features: Automotive AEC-Q200; Resistor Type: Thick Film; Case Code (Imperial): 0402; Weight: 2.3E-05oz; Power Rating: 63mW
R15 = CMP-009-00009-12: Chip Resistor, 1 KOhm, +/- 1%, 0.1 W, -55 to 155 degC, 0402 (1005 Metric); Power: 100mW; Voltage Rating: 50V; RoHS Compliant: True; Case/Package: 0402; Mounting Technology: SM; Pins: 2; Max Operating Temperature: 155°C; Min Operating Temperature: -55°C; Tolerance: 1%; Mfr. Part No.: ERJ-2RKF1001X
R16-R18 = CMP-009-00034-11: Chip Resistor, 4.7 KOhm, +/- 1%, 63 mW, -55 to 155 degC, 0402 (1005 Metric); Voltage Rating: 50V; Power: 63mW; Tolerance: 1%; Pins: 2; Case/Package: 0402; Mounting Technology: SM; Min Operating Temperature: -55°C; Max Operating Temperature: 155°C; RoHS Compliant: True; Resistance: 4.7k; Mfr. Part No.: RC0402FR-074K7L
R19 = CMP-009-00132-9: Chip Resistor, 330 Ohms, +/-5 %, 63 mW, -55 to 155 degC, 0402; Power: 63mW; Tolerance: 5%; Case/Package: 0402; Pins: 2; Max Operating Temperature: 155°C; Min Operating Temperature: -55°C; Mfr. Part No.: CRCW0402330RJNTD
R32 = CMP-009-00149-9: as R9 on sheet Sheet2; Pins: 2; Max Operating Temperature: 155°C; Min Operating Temperature: -55°C; Case/Package: 0402; Mfr. Part No.: CRCW040210K0FKTD
U1 = CMP-003-000001-14: Package: MAPBGA; Design Item ID: MCIMX6Y2DVM05AB; Mfr. Part Nr.: MCIMX6Y2DVM05AB; Source: Schlib1.SchLib
U5 = CMP-015-00008-8: MICROCHIP - KSZ8081RNACA - ETHERNET TRANSCEIVER, 100MBPS, QFN-24; Simplex/Duplex: Full Duplex; Min Operating Temperature: 0°C; Case/Package: QFN; Packaging: Rail/Tube; RoHS Compliant: Yes; Mount: Surface Mount; Max Operating Temperature: 70°C

## Sheet Sheet4.SchDoc
size A4; SheetNumber: 4; SheetTotal: 6
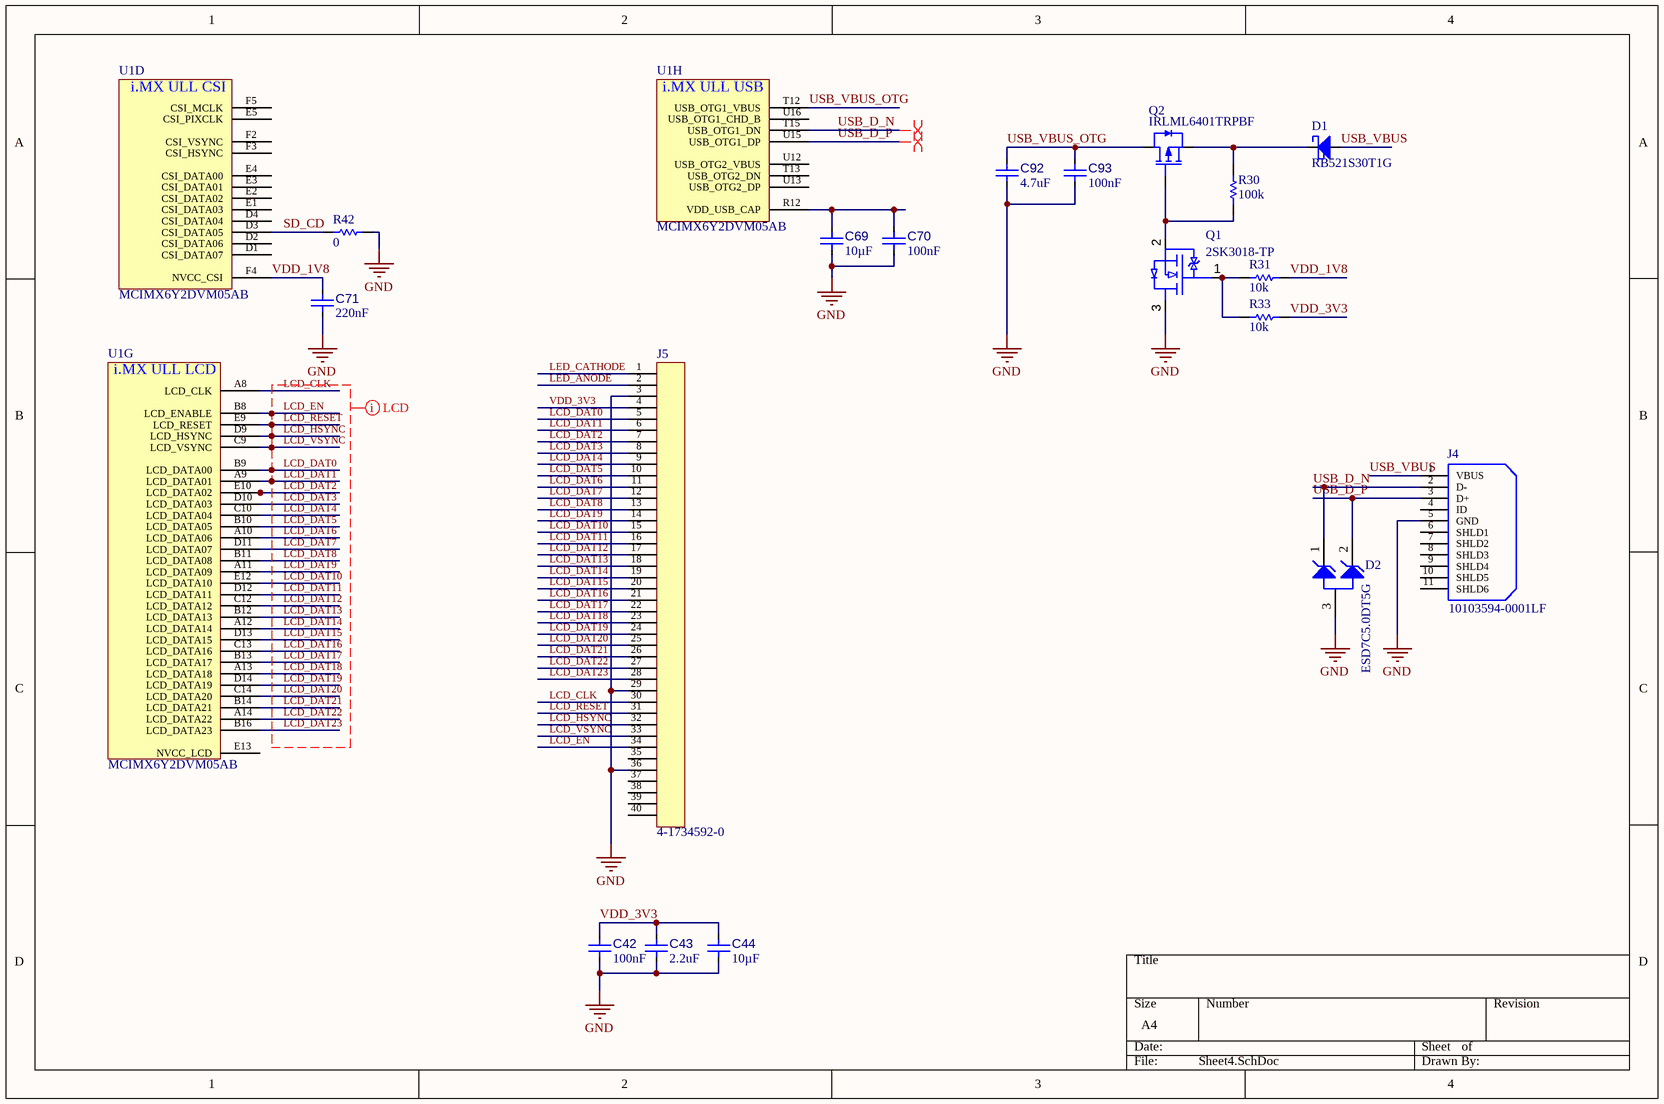
[diagram p3: Sheet4.SchDoc]

### Parts
C42  value 100nF  [0402-SMD-CAP]  (hidden comment: EMF105B7104MVHF)
C43  value 2.2uF  [0603-SMD-CAP]  (hidden comment: GRM188R71A225KE15D)
C44  value 10µF  [0805-SMD-CAP]  (hidden comment: 0805YD106KAT2A)
C69  value 10µF  [0603-SMD-CAP]  (hidden comment: 0603ZD106KAT2A)
C70  value 100nF  [0402-SMD-CAP]  (hidden comment: EMF105B7104MVHF)
C71  value 220nF  [0402-SMD-CAP]  (hidden comment: GRM155R71C224KA12D)
C92  value 4.7uF  [0603-SMD-CAP]  (hidden comment: C0603C475K9PACTU)
C93  value 100nF  [0402-SMD-CAP]  (hidden comment: EMF105B7104MVHF)
D1  RB521S30T1G  [ONSC-SOD-523-2-502-01_V]
D2  ESD7C5.0DT5G  [ONSC-SOT-723-3-631AA-01_V]
J4  10103594-0001LF  [FCI-10103594-0001LF_V]
J5  4-1734592-0  [4-1734592-0-Footprint-1]
Q1  2SK3018-TP  [SOT323]
Q2  IRLML6401TRPBF  [SOT323-IRLML6401]
R30  value 100k  [0402_SMD_RES]  (hidden comment: RC0402FR-07100KL)
R31  value 10k  [0402_SMD_RES]  (hidden comment: Resistor 10k +/-1% 0402 63 mW)
R33  value 10k  [0402_SMD_RES]  (hidden comment: Resistor 10k +/-1% 0402 63 mW)
R42  value 0  [0402_SMD_RES]  (hidden comment: RCS04020000Z0ED)
U1  MCIMX6Y2DVM05AB  [BGA100P9X9-81A]  (parts D,G,H of 11)

### Nets
GND: C42.1 C43.1 C44.2 C69.2 C70.1 C71.2 C92.2 C93.1 D2.3(A) J4.5(GND) J5.3 J5.29 J5.36 Q1.3(D) R42.2
LCD_CLK: J5.30 U1.A8(LCD_CLK)
LCD_DAT0: J5.5 U1.B9(LCD_DATA00)
LCD_DAT1: J5.6 U1.A9(LCD_DATA01)
LCD_DAT2: J5.7 U1.E10(LCD_DATA02)
LCD_DAT3: J5.8 U1.D10(LCD_DATA03)
LCD_DAT4: J5.9 U1.C10(LCD_DATA04)
LCD_DAT5: J5.10 U1.B10(LCD_DATA05)
LCD_DAT6: J5.11 U1.A10(LCD_DATA06)
LCD_DAT7: J5.12 U1.D11(LCD_DATA07)
LCD_DAT8: J5.13 U1.B11(LCD_DATA08)
LCD_DAT9: J5.14 U1.A11(LCD_DATA09)
LCD_DAT10: J5.15 U1.E12(LCD_DATA10)
LCD_DAT11: J5.16 U1.D12(LCD_DATA11)
LCD_DAT12: J5.17 U1.C12(LCD_DATA12)
LCD_DAT13: J5.18 U1.B12(LCD_DATA13)
LCD_DAT14: J5.19 U1.A12(LCD_DATA14)
LCD_DAT15: J5.20 U1.D13(LCD_DATA15)
LCD_DAT16: J5.21 U1.C13(LCD_DATA16)
LCD_DAT17: J5.22 U1.B13(LCD_DATA17)
LCD_DAT18: J5.23 U1.A13(LCD_DATA18)
LCD_DAT19: J5.24 U1.D14(LCD_DATA19)
LCD_DAT20: J5.25 U1.C14(LCD_DATA20)
LCD_DAT21: J5.26 U1.B14(LCD_DATA21)
LCD_DAT22: J5.27 U1.A14(LCD_DATA22)
LCD_DAT23: J5.28 U1.B16(LCD_DATA23)
LCD_EN: J5.34 U1.B8(LCD_ENABLE)
LCD_HSYNC: J5.32 U1.D9(LCD_HSYNC)
LCD_RESET: J5.31 U1.E9(LCD_RESET)
LCD_VSYNC: J5.33 U1.C9(LCD_VSYNC)
LED_ANODE: J5.2
LED_CATHODE: J5.1
SD_CD: R42.1 U1.D3(CSI_DATA05)
USB_D_N: D2.1(K1) J4.2(D-) U1.T15(USB_OTG1_DN)
USB_D_P: D2.2(K2) J4.3(D+) U1.U15(USB_OTG1_DP)
USB_VBUS: D1.1(A) J4.1(VBUS)
USB_VBUS_OTG: C92.1 C93.2 Q2.3(DRAIN) U1.T12(USB_OTG1_VBUS)
VDD_1V8: C71.1 R31.1 U1.F4(NVCC_CSI)
VDD_3V3: C42.2 C43.2 C44.1 J5.4 R33.1
NetC69_1: C69.1 C70.2 U1.R12(VDD_USB_CAP)
NetD1_2: D1.2(K) Q2.2(SOURCE) R30.2
NetQ1_1: Q1.1(G) R31.2 R33.2
NetQ1_2: Q1.2(S) Q2.1(GATE) R30.1

Not connected (* = marked no-connect by the designer): J4 4(ID) 6(SHLD1) 7(SHLD2) 8(SHLD3) 9(SHLD4) 10(SHLD5) 11(SHLD6); J5 35 37 38 39 40; U1 D1(CSI_DATA07) D2(CSI_DATA06) D4(CSI_DATA04) E1(CSI_DATA03) E2(CSI_DATA02) E3(CSI_DATA01) E4(CSI_DATA00) E5(CSI_PIXCLK) E13(NVCC_LCD) F2(CSI_VSYNC) F3(CSI_HSYNC) F5(CSI_MCLK) T13(USB_OTG2_DN) U12(USB_OTG2_VBUS) U13(USB_OTG2_DP) U16(USB_OTG1_CHD_B)

### Layout directives
net class LCD: LCD_CLK, LCD_DAT0, LCD_DAT1, LCD_DAT2, LCD_DAT3, LCD_DAT4, LCD_DAT5, LCD_DAT6, LCD_DAT7, LCD_DAT8, LCD_DAT9, LCD_DAT10, LCD_DAT11, LCD_DAT12, LCD_DAT13, LCD_DAT14, LCD_DAT15, LCD_DAT16, LCD_DAT17, LCD_DAT18, LCD_DAT19, LCD_DAT20, LCD_DAT21, LCD_DAT22, LCD_DAT23, LCD_EN, LCD_HSYNC, LCD_RESET, LCD_VSYNC
differential pair: USB_D_N, USB_D_P

### Notes on the sheet
- (in symbol CMP-003-000001-14, part D) i.MX ULL CSI
- (in symbol CMP-003-000001-14, part G) i.MX ULL LCD
- (in symbol CMP-003-000001-14, part H) i.MX ULL USB

### Library data of the parts
C42 C70 C93 = CMP-001-00001-14: as C3 on sheet Sheet1; Case/Package: 0402; Max Operating Temperature: 125°C; Mounting Technology: SM; RoHS Compliant: True; Pins: 2; Min Operating Temperature: -55°C; Tolerance: 5%; Mfr. Part No.: EMF105B7104MVHF
C43 = CMP-001-00083-8: as C36 on sheet Sheet3; Height: 0.8mm; Capacitance: 2.2uF; Case Code (Imperial): 0603; Termination: Standard; Voltage Rating (DC): 10V; Voltage: 10V; RoHS Compliant: Yes; Length: 1.6mm; Thickness: 0.035inch; Case Code (Metric): 1608; REACH SVHC: No SVHC; Package Quantity: 4000; Case/Package: 0603; Mount: Surface Mount; Depth: 0.8mm; Packaging: Cut Tape; Lead Free: Lead Free; Series: GRM; Width: 0.8mm; Dielectric: X7R; Number of Pins: 2; Weight: 0.000222oz; Max Operating Temperature: 125°C; Voltage Rating: 10V; Min Operating Temperature: -55°C
C44 = CMP-001-00015-12: Chip Capacitor, 10 uF, +/- 10%, 16 V, 0805 (2012 Metric); Capacitor Type: Ceramic; Voltage Rating: 16V; Pins: 2; Mounting Technology: SM; Max Operating Temperature: 85°C; Tolerance: 10%; Case/Package: 0805; RoHS Compliant: True; Min Operating Temperature: -55°C; Mfr. Part No.: 0805YD106KAT2A
C69 = CMP-001-00075-11: as C8 on sheet Sheet2; Pins: 2; Case/Package: 0603; Mounting Technology: SMT; Max Operating Temperature: 85°C; Min Operating Temperature: -55°C; Voltage Rating: 10V; Mfr. Part No.: 0603ZD106KAT2A
C71 = CMP-001-00090-10: as C65 on sheet Sheet1; Package Quantity: 1; Height: 0.5mm; Tolerance: 10%; Case/Package: 0402; Case Code (Metric): 1005; Packaging: Tape and Reel; Min Operating Temperature: -55°C; Mount: Surface Mount; RoHS Compliant: Yes; Thickness: 0.022inch; Depth: 0.5mm; Lead Free: Lead Free; Series: GRM; REACH SVHC: No SVHC; Width: 0.02inch; Voltage Rating: 16V; Material: Ceramic; Radiation Hardening: No; Voltage Rating (DC): 16V; Capacitance: 220nF; Max Operating Temperature: 125°C; Length: 1mm; Construction: Flat; Dielectric: X7R; Termination: SMD/SMT; Case Code (Imperial): 0402
C92 = CMP-001-00092-7: KEMET - C0603C475K9PACTU - SMD Multilayer Ceramic Capacitor, 4.7 µF, 6.3 V, 0603 [1608 Metric], ± 10%, X5R, C Series KEMET; Dissipation Factor: 5%; Voltage Rating: 6.3V; Radiation Hardening: No; Lead Pitch: 0.7mm; Case Code (Metric): 1608; Case Code (Imperial): 0603; Length: 1.6mm; Series: C; Dielectric Material: Ceramic; Height: 0.8mm; Package Quantity: 1; Termination: SMD/SMT; Dielectric: X5R; Thickness: 0.035inch; Mount: Surface Mount,PCB; Construction: Flat; Capacitance: 4.7uF; RoHS Compliant: Yes; REACH SVHC: No SVHC; Tolerance: 10%; Number of Pins: 2; Width: 0.031inch; Contact Plating: Tin,Matte; Packaging: Tape and Reel; Case/Package: 0603; Max Operating Temperature: 85°C; Lead Free: Lead Free; Depth: 0.8mm; Voltage: 6.3V; Min Operating Temperature: -55°C; Voltage Rating (DC): 6.3V
D1 = CMP-004-00031-4: ON SEMICONDUCTOR - RB521S30T1G - Small Signal Schottky Diode, Single, 30 V, 200 mA, 500 mV, 1 A, 125 °C; Max Reverse Voltage (DC): 30V; Forward Voltage: 500mV; Polarity: Standard; Peak Non-Repetitive Surge Current: 1A; Average Rectified Current: 200mA; Power Dissipation: 200mW; Max Reverse Current: 30uA; RoHS Compliant: Yes; Width: 0.9mm; Voltage Rating (DC): 30V; Max Operating Temperature: 125°C; Radiation Hardening: No; Element Configuration: Single; Height: 0.7mm; Number of Pins: 2; Max Forward Surge Current (Ifsm): 1A; Package Quantity: 1; REACH SVHC: No SVHC; Lead Free: Lead Free; Packaging: Tape and Reel; Current Rating: 200mA; Output Current: 200mA; Forward Current: 200mA; Length: 1.3mm; Max Repetitive Reverse Voltage (Vrrm): 30V; Max Surge Current: 1A; Contact Plating: Tin,Matte; Max Reverse Leakage Current: 30uA; Case/Package: SOD-523-2; Min Operating Temperature: -55°C
D2 = CMP-004-00032-2: ESD Suppressor TVS 15KV 3-Pin SOT-723 T/R; Test Current: 1mA; ESD Protection: Yes; Max Power Dissipation: 240mW; Diode Type: ZENER; Number of Lines: 2; Capacitance: 6.2pF; Power Line Protection: No; Clamping Voltage-Max: 10V; Max Breakdown Voltage: 11V; Max Reverse Leakage Current: 500nA; Polarity: Unidirectional; Element Configuration: Common Anode; Reverse Standoff Voltage: 5V; Number of Pins: 3; Halogen Free: Halogen Free; Contact Plating: Tin,Matte; Packaging: Tape and Reel; Height: 0.55mm; Depth: 0.8mm; Package Quantity: 1; Series: Automotive, AEC-Q101; RoHS Compliant: Yes; Length: 1.2mm; Peak Pulse Power: 240mW; Number of Unidirectional Channels: 2; Case/Package: SOT-723-3; Termination: SMD/SMT; Min Operating Temperature: -55°C; Lead Free: Lead Free; Radiation Hardening: No; Resistor Type: Zener; Min Breakdown Voltage: 11V; Max Operating Temperature: 150°C; Direction: Unidirectional; Clamping Voltage: 10V; Working Voltage: 5V; Operating Supply Voltage: 5V; Number of Channels: 2; REACH SVHC: No SVHC; Leakage Current: 500nA; Width: 0.85mm; Breakdown Voltage: 11V
J4 = CMP-002-00038-7: Micro USB 2.0 B Receptacle, 5 Position, Height 3.24 mm, -55 to 85 degC, RoHS, Tape and Reel; Manufacturer: FCI Electronics; Voltage Rating: 100V; Gender: Female; Current Rating: 1.8A; Min Operating Temperature: -55°C; Pins: 5; Contact Plating: Gold; Package Description: 5-Pin Surface Mount Device, Body 8.04 x 5.62 mm; RoHS Compliant: True; Lead Pitch: 0.65mm; Packaging: TapeandReel; Case/Package: FCI-10103594-0001LF; Manufacturer URL: http://portal.fciconnect.com/; Mounting Technology: SM; Datasheet Version: Rev. A, 06/2010; Connector Type: USB; Contact Material: Copper; Datasheet URL: http://portal.fciconnect.com/Comergent//fci/drawing/10103594.pdf; Max Operating Temperature: 85°C; Package Quantity: 1500; Package Reference: FCI-10103594-0001LF
J5 = CMP-002-00074-4: FFC/FPC CONNECTOR, RECEPTACLE 40 POSITION 1ROW; Product Range:-; Contact Termination Type:Surface Mount; Gender:Receptacle; No. of Contacts:40; Contact Position:Bottom; Pitch Spacing:0.5mm; FFC / FPC Thickness:0.3mm; No. of Rows:1 ;RoHS Compliant: Yes; Number of Positions: 40; Contact Current Rating: 500mA; Pitch: 0.5mm; Plating Thickness: 0.025um; Contact Location: Bottom; Contact Resistance: 35mR; Actuator Color: Beige; PCB Mount Alignment: No (Without); PCB Mounting Orientation: Right Angle; Wire/Cable Type: Flat Flex; Max Voltage Rating (AC): 250V; PCB Mount Retention: With; Connector System: Flex-to-Board; Gender: Female; Shrouded: Yes (With); Shielding: Unshielded; Connector Type: Receptacle,Connector,Socket; Actuator Material: Thermoplastic; Housing Color: Natural; RoHS Compliant: Yes; Housing Material: Polymer; Series: -; Number of Contacts: 40; Contact Material: Bronze; Lead Free: Lead Free; Package Quantity: 2000; Min Operating Temperature: -40°C; REACH SVHC: No SVHC; Depth: 5.1mm; Number of Rows: 1; Length: 25.43mm; ELV: Compliant; Flammability Rating: UL94 V-0; Current Rating: 500mA; Termination: SMD/SMT; Voltage Rating: 250V; Height: 2.05mm; Radiation Hardening: No; Contact Plating: Gold; Mating Alignment: Yes (With); Width: 5.1mm; Max Operating Temperature: 85°C; Packaging: Tape and Reel; Orientation: Right Angle; Mount: Surface Mount; Sealable: No (Without)
Q1 = CMP-013-00034-6: N-CHANNEL MOSFET, SOT-323 PACKAG; Max Power Dissipation: 200mW; Rds On Max: 8R; Continuous Drain Current (ID): 100mA; Drain to Source Voltage (Vdss): 30V; Input Capacitance: 13pF; Min Operating Temperature: -55°C; Case/Package: SOT-323; Mount: Surface Mount; Packaging: Tape and Reel; Max Operating Temperature: 150°C
Q2 = CMP-013-00035-10: Trans MOSFET P-CH 12V 4.3A 3-Pin Micro T/R; Drain to Source Resistance: 50mR; Turn-On Delay Time: 11ns; Element Configuration: Single; Nominal Vgs: -550mV; Max Power Dissipation: 1.3W; Voltage Rating (DC): -12V; Current Rating: -4.3A; Rise Time: 32ns; Turn-Off Delay Time: 250ns; Fall Time: 210ns; Number of Elements: 1; Input Capacitance: 830pF; Gate to Source Voltage (Vgs): 8V; Length: 3.04mm; Series: HEXFET®; Termination: SMD/SMT; Packaging: Tape and Reel; Lead Free: Lead Free; Power Dissipation: 1.3W; RoHS Compliant: Yes; Package Quantity: 1; Threshold Voltage: -550mV; Continuous Drain Current (ID): 4.3A; Dual Supply Voltage: -12V; Max Operating Temperature: 150°C; Mount: Surface Mount; Drain to Source Breakdown Voltage: -12V; Height: 1.02mm; Min Operating Temperature: -55°C; Drain to Source Voltage (Vdss): 12V; Rds On Max: 50mR; Width: 1.4mm; Radiation Hardening: No; Case/Package: TO-236-3; Number of Pins: 3; On-State Resistance: 50mR; REACH SVHC: No SVHC; Value: IRLML6401TRPBF
R30 = CMP-009-00021-11: Chip Resistor, 100 KOhm, +/- 1%, 0.063 W, -55 to 155 degC, 0402 (1005 Metric); Voltage Rating: 50V; Power: 63mW; RoHS Compliant: True; Max Operating Temperature: 155°C; Tolerance: 1%; Min Operating Temperature: -55°C; Case/Package: 0402; Mounting Technology: SM; Pins: 2; Mfr. Part No.: RC0402FR-07100KL
R31 R33 = CMP-009-00019-13: as R1 on sheet Sheet1; Min Operating Temperature: -55°C; Pins: 2; Case/Package: 0402; Max Operating Temperature: 155°C; Resistance: 10k; Mounting Technology: SM; RoHS Compliant: True; Tolerance: 1%
R42 = CMP-009-00005-12: as R39 on sheet Sheet1; Min Operating Temperature: -55°C; Mounting Technology: SM; RoHS Compliant: True; Max Operating Temperature: 155°C; Pins: 2; Case/Package: 0402; Mfr. Part No.: RCS04020000Z0ED
U1 = CMP-003-000001-14: Package: MAPBGA; Design Item ID: MCIMX6Y2DVM05AB; Mfr. Part Nr.: MCIMX6Y2DVM05AB; Source: Schlib1.SchLib